# Altium schematic sheet Sheet1.SchDoc
size A; SheetNumber: 1; SheetTotal: 1
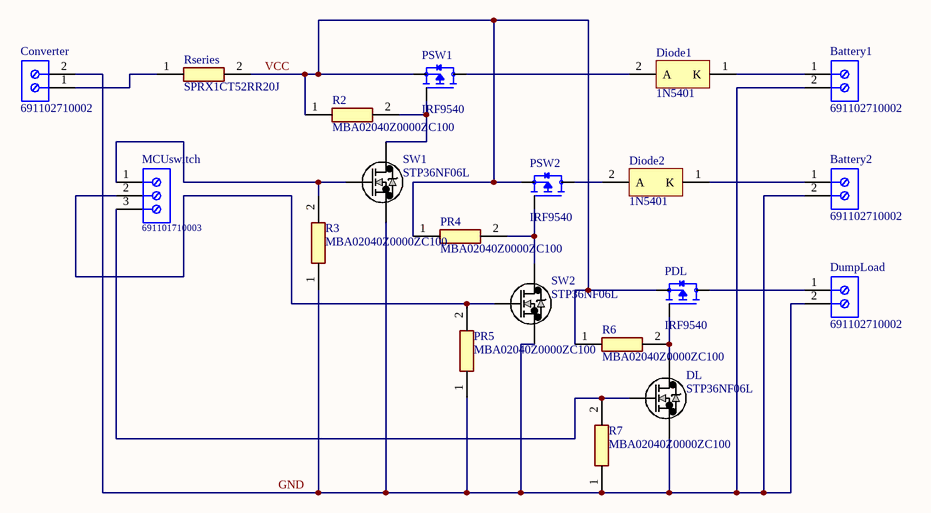
[diagram p0: Sheet1.SchDoc]

## Parts
Battery1  691102710002  [691102710002]
Battery2  691102710002  [691102710002]
Converter  691102710002  [691102710002]
Diode1  1N5401  [ONSC-AXIAL_LEAD-2-267-05_V]
Diode2  1N5401  [ONSC-AXIAL_LEAD-2-267-05_V]
DL  STP36NF06L  [TO-220_STM]
DumpLoad  691102710002  [691102710002]
MCUswitch  691101710003  [691101710003]
PDL  IRF9540  [TO254P1052X465X1989-3]
PR4  MBA02040Z0000ZC100  [RESAD1000W50L360D160]
PR5  MBA02040Z0000ZC100  [RESAD1000W50L360D160]
PSW1  IRF9540  [TO254P1052X465X1989-3]
PSW2  IRF9540  [TO254P1052X465X1989-3]
R2  MBA02040Z0000ZC100  [RESAD1000W50L360D160]
R3  MBA02040Z0000ZC100  [RESAD1000W50L360D160]
R6  MBA02040Z0000ZC100  [RESAD1000W50L360D160]
R7  MBA02040Z0000ZC100  [RESAD1000W50L360D160]
Rseries  SPRX1CT52RR20J  [RESAD2300W80L900D350]
SW1  STP36NF06L  [TO-220_STM]
SW2  STP36NF06L  [TO-220_STM]

## Nets
GND: Battery1.2 Battery2.2 Converter.2 DL.3 DumpLoad.2 PR5.1 R3.1 R7.1 SW1.3 SW2.3
VCC: PDL.3(S) PR4.1 PSW1.3(S) PSW2.3(S) R2.1 R6.1 Rseries.2
NetBattery1_1: Battery1.1 Diode1.1(K)
NetBattery2_1: Battery2.1 Diode2.1(K)
NetConverter_1: Converter.1 Rseries.1
NetDiode1_2: Diode1.2(A) PSW1.2(D)
NetDiode2_2: Diode2.2(A) PSW2.2(D)
NetDL_1: DL.1 MCUswitch.3 R7.2
NetDL_2: DL.2 PDL.1(G) R6.2
NetDumpLoad_1: DumpLoad.1 PDL.2(D)
NetMCUswitch_1: MCUswitch.1 R3.2 SW1.1
NetMCUswitch_2: MCUswitch.2 PR5.2 SW2.1
NetPR4_2: PR4.2 PSW2.1(G) SW2.2
NetPSW1_1: PSW1.1(G) R2.2 SW1.2

## Library data of the parts
Battery1 Battery2 Converter DumpLoad = CMP-1502-03258-1: Series 102 - 5.00 mm Horizontal Entry Modular with Pressure Clamp WR-TBL, 2 pin; Manufacturer: Wurth Elektronik; Pin Number: 2; Pitch: 5.00mm; Manufacturer URL: http://www.we-online.de; Mounting Technology: THT; Publisher: WurthElektronik; Packaging: Box; Package Reference: 691102710002; Datasheet URL: http://katalog.we-online.de/em/datasheet/6911027100xx.pdf; Operating Temperature: -40to105degC; Part Number: 691102710002
Diode1 Diode2 = CMP-0902-00078-1: Standard Recovery Rectifier, 2-Pin Axial_Lead, Pb-Free, Bulk Box; Manufacturer: On Semiconductor; IO(rec) Max (A): 3; VRRM Max (V): 100; IFSM Max (A): 200; PartNumber: 1N5401; RoHS: TRUE; ComponentLink1URL: http://www.onsemi.com/; Mounting Technology: Through Hole; PackageDescription: 2-Pin, Axial Lead, Diameter 5.05 mm; ComponentLink1Description: Manufacturer URL; ComponentLink3Description: Package Specification; ComponentLink2URL: http://www.onsemi.com/pub_link/Collateral/1N5400-D.PDF; Type: Standard Recovery; PackageReference: AXIAL_LEAD-2-267-05; ComponentLink3URL: http://www.onsemi.com/pub_link/Collateral/267-05.PDF; Packing: Bulk Box; DatasheetVersion: Rev. 10; PackageVersion: Rev. G, 06/2000; ComponentLink2Description: Datasheet
DL SW1 SW2 = STP36NF06L: No Description Available; Mfr_Name: STMicroelectronics; Copyright: Copyright (C) 2022 Ultra Librarian. All rights reserved.; Manufacturer_Part_Number: STP36NF06L; Digi-Key_Part_Number_1: 497-7522-5-ND; RefDes: RefDes; Type: DEV
MCUswitch = CMP-1502-03257-1: Series 101 - 5.00 mm Horizontal Entry Modular with Pressure Clamp WR-TBL, 3 pin; Manufacturer: Wurth Elektronik; Pitch: 5.00mm; Pin Number: 3; Publisher: WurthElektronik; Part Number: 691101710003; Operating Temperature: -40to105degC; Package Reference: 691101710003; Packaging: Box; Manufacturer URL: http://www.we-online.de; Datasheet URL: http://katalog.we-online.de/em/datasheet/6911017100xx.pdf; Mounting Technology: THT
PDL PSW1 PSW2 = IRF9540: P-Channel 100V 19A (Tc) 150W (Tc) Through Hole TO-220AB; MF: Vishay Siliconix; MP: IRF9540; Package: TO-220 International Rectifier; Value: *; Digi-Key_Part_Number: IRF9540PBF-ND; SnapEDA_Link: https://www.snapeda.com/parts/IRF9540/Vishay%20Siliconix/view-part/1087953/?ref=snap
PR4 PR5 R2 R3 R6 R7 = MBA02040Z0000ZC100: Resistor; Manufacturer_Name: Vishay; Datasheet Link: https://www.vishay.com/docs/28766/mbxsma.pdf; Manufacturer_Part_Number: MBA02040Z0000ZC100
Rseries = SPRX1CT52RR20J: Resistor; Manufacturer_Name: KOA Speer; Datasheet Link: https://componentsearchengine.com/Datasheets/1/SPRX1CT52RR20J.pdf; Manufacturer_Part_Number: SPRX1CT52RR20J